# EasyEDA Pro project New Project_2025-03-25_15-12-27.eprj, board PCB1_1
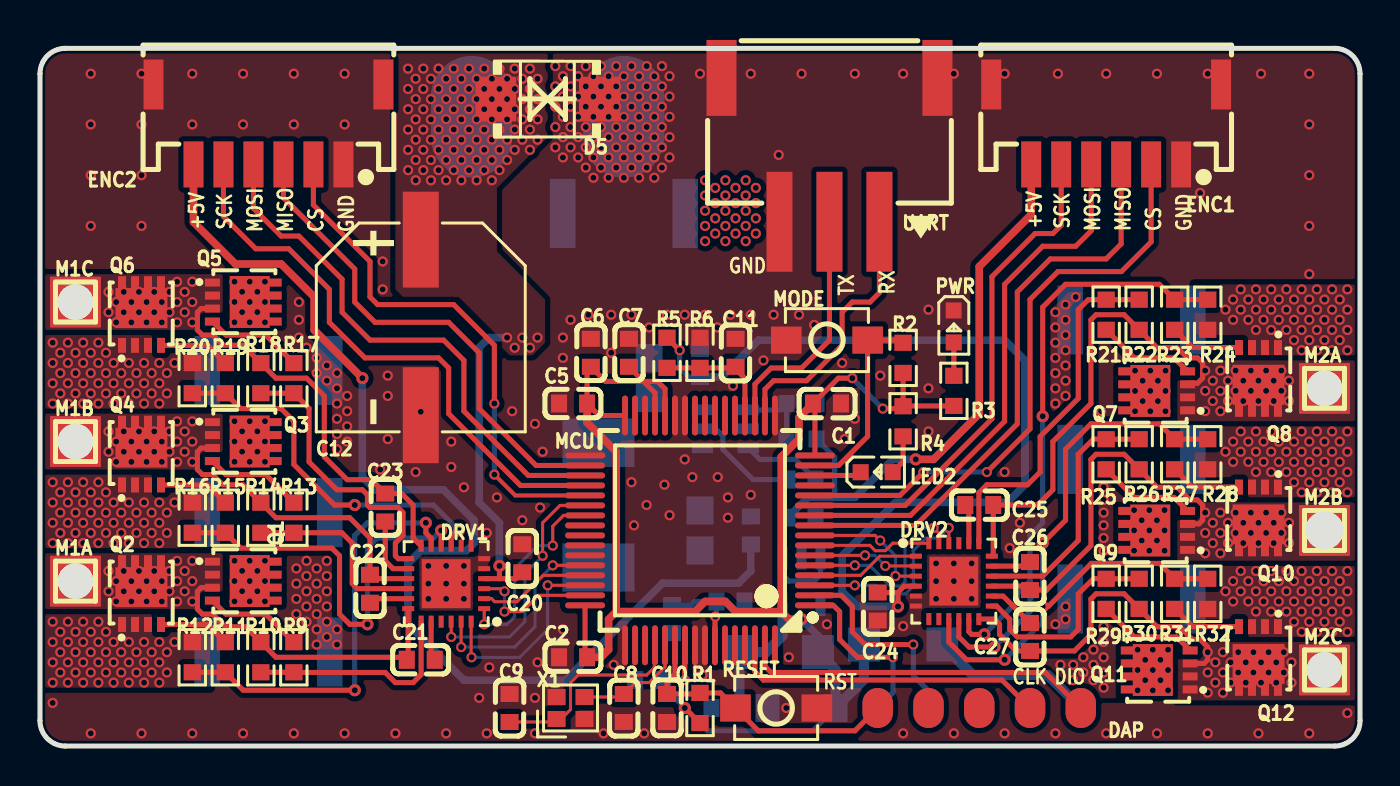
[diagram p6: board, top side]
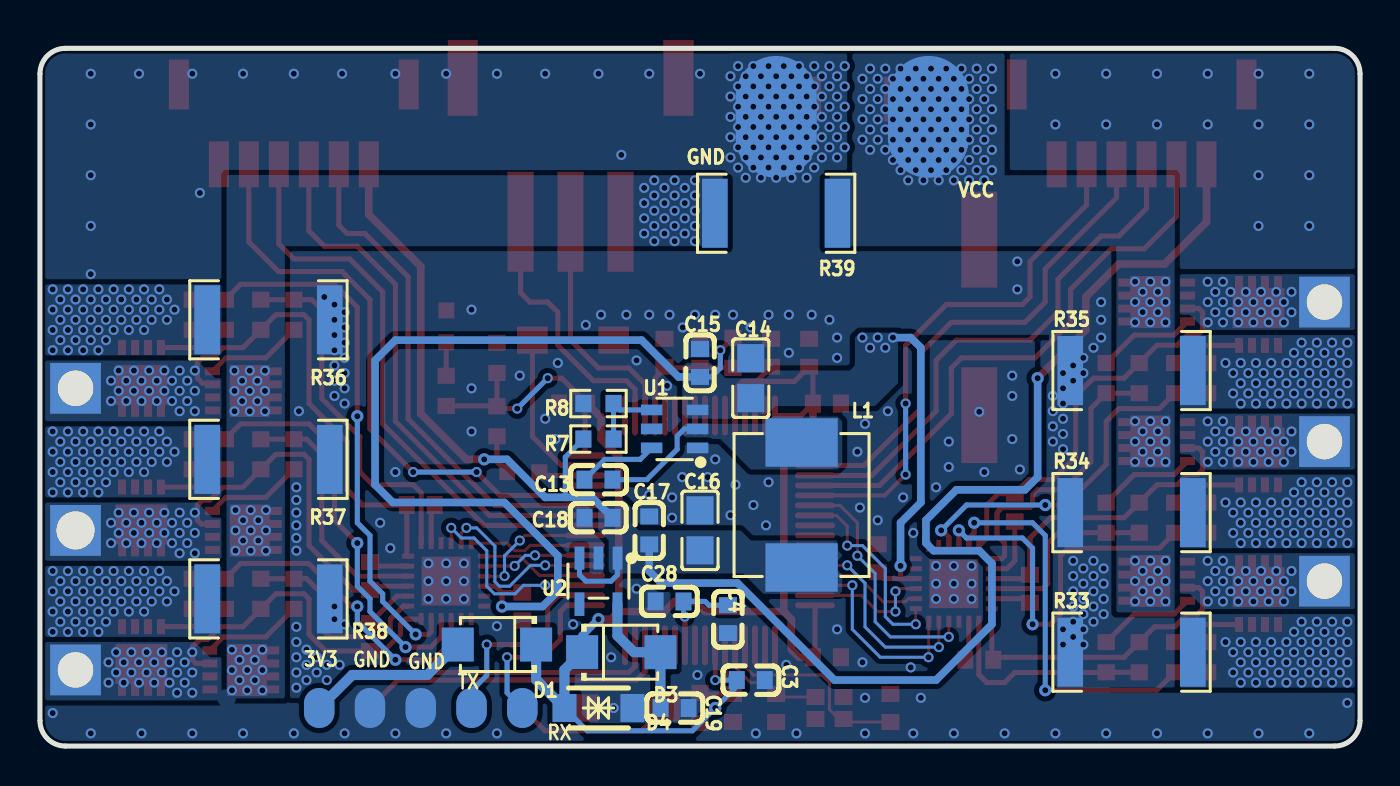
[diagram p7: board, bottom side, seen from below]

Outline 66.04 x 34.92 mm; copper layers: Top Layer, Inner1, Inner2, Bottom Layer. Coordinates in mm from the lower left corner of the outline.
Outline path: 0,33.66 arc(0.37,34.55) 1.27,34.92 64.77,34.92 arc(65.67,34.55) 66.04,33.66 66.04,1.27 arc(65.67,0.37) 64.77,0 1.27,0 arc(0.37,0.37) 0,1.27 0,33.66
Stack: Top Layer 0.035mm 外层铜厚1oz / Dielectric1 0.2104mm 7628 RC49% 8.6mil / Inner1 0.0152mm 内层铜厚 / Dielectric2 1.065mm 1.1mm H/HOZ 含铜 / Inner2 0.0152mm 内层铜厚 / Dielectric3 0.2104mm 7628 RC49% 8.6mil / Bottom Layer 0.035mm 外层铜厚1oz

## Design rules (mm)
template: 自定义配置
spacing copperThickness1oz (default): track to track 0.102, other pairs 0.152 to 0.3
spacing copperThickness2oz: track to track 0.203, other pairs 0.152 to 0.3
track width copperThickness1oz (default): min 0.127, default 0.254, max 2.54
track width copperThickness2oz: min 0.203, default 0.254, max 2.54
differential pair differentialPair (default): width min 0.127, default 0.254, max 2.54; gap min 0.152, default 0.152
via viaSize (default): diameter min 0.5, default 0.508, max 10; hole min 0.3, default 0.305, max 6.3

## Placement (name value [footprint] x y rotation side)
C1  100nF  [C0603]  39.37 17.14 180 top
C2  100nF  [C0603]  26.67 4.45 0 top
C3  100nF  [C0603]  30.48 3.3 0 bottom
C4  4.7uF  [C0603]  31.62 6.35 90 bottom
C5  100nF  [C0603]  26.67 17.14 0 top
C6  100nF  [C0603]  27.56 19.69 270 top
C7  100nF  [C0603]  29.46 19.69 270 top
C8  20pF  [C0603]  29.21 1.91 90 top
C9  20pF  [C0603]  23.49 1.91 90 top
C10  100nF  [C0603]  31.37 1.91 270 top
C11  1uF  [C0603]  34.8 19.69 90 top
C12  470uF  [CAP-SMD_BD10.0-L10.3-W10.3-LS11.0-R-RD]  19.05 20.95 90 top
C13  100nF  [C0603]  38.1 13.34 0 bottom
C14  22uF  [C0805]  30.48 18.42 270 bottom
C15  100nF  [C0603]  33.02 19.18 270 bottom
C16  22uF  [C0805]  33.02 10.8 90 bottom
C17  100nF  [C0603]  35.56 10.8 90 bottom
C18  1uF  [C0603]  38.1 11.43 180 bottom
C19  100nF  [C0603]  34.29 1.91 0 bottom
C20  1uF  [C0603]  24.13 9.4 90 top
C21  1uF  [C0603]  19.05 4.32 0 top
C22  1uF  [C0603]  16.51 7.87 270 top
C23  1uF  [C0603]  17.27 11.94 270 top
C24  1uF  [C0603]  41.91 6.98 270 top
C25  1uF  [C0603]  46.99 12.06 180 top
C26  1uF  [C0603]  49.53 8.51 90 top
C27  1uF  [C0603]  49.53 5.46 90 top
C28  100nF  [C0603]  34.54 7.24 180 bottom
D1  SS54F  [SMAF_L3.5-W2.6-LS4.7-RD-1]  43.18 5.08 0 bottom
D3  SS54F  [SMAF_L3.5-W2.6-LS4.7-RD-1]  36.96 4.7 180 bottom
D4  SMF3.3CA  [SOD-123FL_L2.8-W1.8-LS3.7-BI]  38.1 1.91 0 bottom
D5  SMBJ12CA  [SMB_L4.6-W3.6-LS5.4-BI]  25.4 32.39 180 top
DAP  SWD  [2X5 2.54MM双层贴片焊盘]  46.99 1.91 270 top
DRV1  DRV8300DRGER  [VQFN-24_L4.0-W4.0-P0.50-TL-EP2.5]  20.32 8.13 180 top
DRV2  DRV8300DRGER  [VQFN-24_L4.0-W4.0-P0.50-TL-EP2.5]  45.72 8.25 0 top
ENC1  ZX-ZH1.5-6PWT  [CONN-SMD_6P-P1.50_ZX-ZH1.5-6PWT]  53.34 31.11 180 top
ENC2  ZX-ZH1.5-6PWT  [CONN-SMD_6P-P1.50_ZX-ZH1.5-6PWT]  11.43 31.11 180 top
GND  -  [焊盘]  29.21 31.5 270 bottom
L1  15uH  [IND-SMD_L7.0-W6.6_FXL0630]  27.94 12.06 270 bottom
LED2  -  [LED_0603]  41.91 13.72 0 top
M1A  -  [hdr-th_1p-v-m_xkb_x4611wv-01i-c28d40]  1.78 8.25 0 top
M1B  -  [hdr-th_1p-v-m_xkb_x4611wv-01i-c28d40]  1.78 15.24 0 top
M1C  -  [hdr-th_1p-v-m_xkb_x4611wv-01i-c28d40]  1.78 22.23 0 top
M2A  -  [hdr-th_1p-v-m_xkb_x4611wv-01i-c28d40]  64.26 17.91 0 top
M2B  -  [hdr-th_1p-v-m_xkb_x4611wv-01i-c28d40#2]  64.26 10.8 0 top
M2C  -  [hdr-th_1p-v-m_xkb_x4611wv-01i-c28d40]  64.26 3.81 0 top
MCU  CYT2BL3CAAQ0AZEGST  [LQFP-64_L10.0-W10.0-P0.50-LS12.0-BL]  33.02 10.8 90 top
MODE  -  [Key_SMD_3x4x2]  39.37 20.32 180 top
PWR  -  [LED_0603]  45.72 20.95 270 top
Q1  WSD4070DN33  [PDFN3333-8_L3.1-W3.2-P0.65-LS3.4-BL]  10.16 8.25 270 top
Q2  WSD4070DN33  [PDFN3333-8_L3.1-W3.2-P0.65-LS3.4-BL]  5.08 7.62 0 top
Q3  WSD4070DN33  [PDFN3333-8_L3.1-W3.2-P0.65-LS3.4-BL]  10.16 15.24 270 top
Q4  WSD4070DN33  [PDFN3333-8_L3.1-W3.2-P0.65-LS3.4-BL]  5.08 14.61 0 top
Q5  WSD4070DN33  [PDFN3333-8_L3.1-W3.2-P0.65-LS3.4-BL]  10.16 22.23 270 top
Q6  WSD4070DN33  [PDFN3333-8_L3.1-W3.2-P0.65-LS3.4-BL]  5.08 21.59 0 top
Q7  WSD4070DN33  [PDFN3333-8_L3.1-W3.2-P0.65-LS3.4-BL]  55.88 17.78 90 top
Q8  WSD4070DN33  [PDFN3333-8_L3.1-W3.2-P0.65-LS3.4-BL]  60.96 18.42 180 top
Q9  WSD4070DN33  [PDFN3333-8_L3.1-W3.2-P0.65-LS3.4-BL]  55.88 10.8 90 top
Q10  WSD4070DN33  [PDFN3333-8_L3.1-W3.2-P0.65-LS3.4-BL]  60.96 11.43 180 top
Q11  WSD4070DN33  [PDFN3333-8_L3.1-W3.2-P0.65-LS3.4-BL]  56.01 3.81 90 top
Q12  WSD4070DN33  [PDFN3333-8_L3.1-W3.2-P0.65-LS3.4-BL]  60.96 4.45 180 top
R1  10K  [R0603]  33.02 1.91 270 top
R2  4.7K  [R0603]  43.18 19.43 90 top
R3  4.7K  [R0603]  45.72 17.78 90 top
R4  4.7K  [R0603]  43.18 16.26 270 top
R5  100K  [R0603]  31.37 19.69 270 top
R6  10K  [R0603]  33.02 19.69 90 top
R7  100K  [R0603]  38.1 15.37 180 bottom
R8  13.3K  [R0603]  38.1 17.14 0 bottom
R9  10  [R0603]  12.7 4.45 270 top
R10  10K  [R0603]  11.05 4.45 90 top
R11  10  [R0603]  9.27 4.45 270 top
R12  10K  [R0603]  7.62 4.45 90 top
R13  10  [R0603]  12.7 11.43 270 top
R14  10K  [R0603]  11.05 11.43 90 top
R15  10  [R0603]  9.27 11.43 270 top
R16  10K  [R0603]  7.62 11.43 90 top
R17  10  [R0603]  12.7 18.42 270 top
R18  10K  [R0603]  11.05 18.42 90 top
R19  10  [R0603]  9.27 18.42 270 top
R20  10K  [R0603]  7.62 18.42 90 top
R21  10  [R0603]  53.34 21.59 90 top
R22  10K  [R0603]  54.99 21.59 270 top
R23  10  [R0603]  56.77 21.59 90 top
R24  10K  [R0603]  58.42 21.59 270 top
R25  10  [R0603]  53.34 14.61 90 top
R26  10K  [R0603]  54.99 14.61 270 top
R27  10  [R0603]  56.77 14.61 90 top
R28  10K  [R0603]  58.42 14.61 270 top
R29  10  [R0603]  53.34 7.62 90 top
R30  10K  [R0603]  54.99 7.62 270 top
R31  10  [R0603]  56.77 7.62 90 top
R32  10K  [R0603]  58.42 7.62 270 top
R33  1mΩ  [R2512]  11.43 4.7 180 bottom
R34  1mΩ  [R2512]  11.43 11.68 180 bottom
R35  1mΩ  [R2512]  11.43 18.8 180 bottom
R36  1mΩ  [R2512]  54.61 21.34 0 bottom
R37  1mΩ  [R2512]  54.61 14.35 0 bottom
R38  1mΩ  [R2512]  54.61 7.37 0 bottom
R39  1mΩ  [R2512]  29.21 26.67 0 bottom
RESET  -  [Key_SMD_3x4x2]  36.83 1.91 0 top
U1  TPS54202DDCR  [SOT-23-6_L2.9-W1.6-P0.95-LS2.8-BL]  34.29 15.88 90 bottom
U2  RT9013-33GB  [SOT-23-5_L3.0-W1.7-P0.95-LS2.8-BL]  38.1 8.25 0 bottom
UART  HX 2.54-3P WT  [CONN-SMD_3P-P2.50_HX-2.54-3P-WT]  39.5 29.84 180 top
VCC  -  [焊盘]  21.59 31.5 270 bottom
X1  16MHz  [CRYSTAL-SMD_4P-L2.0-W1.6-BL]  26.54 1.91 0 top

## Footprints (pads in the part's own frame, mm; a bottom-side part is the same pattern mirrored in y, then rotated)
2X5 2.54MM双层贴片焊盘
  oval 2x1.524 smd: 1(0,-5.08) 3(0,-2.54) 5(0,0) 7(0,2.54) 9(0,5.08)
  oval 2x1.524 smd far side: 2(0,-5.08) 4(0,-2.54) 6(0,0) 8(0,2.54) 10(0,5.08)
C0603
  rect 0.8x0.9 smd: 1(-0.7,0) 2(0.7,0)
C0805
  rect 1.41x1.35 smd: 1(-1,0) 2(1,0)
CAP-SMD_BD10.0-L10.3-W10.3-LS11.0-R-RD
  rect 4.8x1.8 smd: 1(4.395,0) 2(-4.395,0)
CONN-SMD_3P-P2.50_HX-2.54-3P-WT
  rect 1.3x5 smd: 1(-2.5,3.6) 2(0,3.6) 3(2.5,3.6)
  rect 1.5x3.8 smd: 4(5.4,-3.6) 5(-5.4,-3.6)
CONN-SMD_6P-P1.50_ZX-ZH1.5-6PWT
  rect 1x2.3 smd: 1(-3.75,2) 2(-2.25,2) 3(-0.75,2) 4(0.75,2) 5(2.25,2) 6(3.75,2)
  rect 1x2.5 smd: 7(5.75,-2) 8(-5.75,-2)
CRYSTAL-SMD_4P-L2.0-W1.6-BL
  rect 0.9x0.8 smd: 1(-0.7,-0.55) 2(0.7,-0.55) 3(0.7,0.55) 4(-0.7,0.55)
hdr-th_1p-v-m_xkb_x4611wv-01i-c28d40
  rect 2.54x2.54 hole 1.778: 1(0,0)
hdr-th_1p-v-m_xkb_x4611wv-01i-c28d40#2
  rect 2.54x2.54 hole 1.905x1.778: 1(0,0)
IND-SMD_L7.0-W6.6_FXL0630
  rect 2.424x3.62 smd: 1(3.128,0) 2(-3.128,0)
Key_SMD_3x4x2
  rect 1.53x1.36 smd: 1(-2.035,0) 2(2.035,0)
LED_0603
  rect 0.8x0.8 smd: 1(-0.851,-0.01) 2(0.75,-0.005)
LQFP-64_L10.0-W10.0-P0.50-LS12.0-BL
  oval 0.3x2 smd: 1(-3.75,-5.75) 2(-3.25,-5.75) 3(-2.75,-5.75) 4(-2.25,-5.75) 5(-1.75,-5.75) 6(-1.25,-5.75) 7(-0.75,-5.75) 8(-0.25,-5.75) 9(0.25,-5.75) 10(0.75,-5.75) 11(1.25,-5.75) 12(1.75,-5.75) 13(2.25,-5.75) 14(2.75,-5.75) 15(3.25,-5.75) 16(3.75,-5.75) 33(3.75,5.75) 34(3.25,5.75) 35(2.75,5.75) 36(2.25,5.75) 37(1.75,5.75) 38(1.25,5.75) 39(0.75,5.75) 40(0.25,5.75) 41(-0.25,5.75) 42(-0.75,5.75) 43(-1.25,5.75) 44(-1.75,5.75) 45(-2.25,5.75) 46(-2.75,5.75) 47(-3.25,5.75) 48(-3.75,5.75)
  oval 2x0.3 smd: 17(5.75,-3.75) 18(5.75,-3.25) 19(5.75,-2.75) 20(5.75,-2.25) 21(5.75,-1.75) 22(5.75,-1.25) 23(5.75,-0.75) 24(5.75,-0.25) 25(5.75,0.25) 26(5.75,0.75) 27(5.75,1.25) 28(5.75,1.75) 29(5.75,2.25) 30(5.75,2.75) 31(5.75,3.25) 32(5.75,3.75) 49(-5.75,3.75) 50(-5.75,3.25) 51(-5.75,2.75) 52(-5.75,2.25) 53(-5.75,1.75) 54(-5.75,1.25) 55(-5.75,0.75) 56(-5.75,0.25) 57(-5.75,-0.25) 58(-5.75,-0.75) 59(-5.75,-1.25) 60(-5.75,-1.75) 61(-5.75,-2.25) 62(-5.75,-2.75) 63(-5.75,-3.25) 64(-5.75,-3.75)
PDFN3333-8_L3.1-W3.2-P0.65-LS3.4-BL
  rect 0.4x0.75 smd: 1(-0.975,-1.534) 2(-0.325,-1.534) 3(0.325,-1.534) 4(0.975,-1.534)
  rect 0.4x0.8 smd: 5(0.975,1.534) 6(0.325,1.534) 7(-0.325,1.534) 8(-0.975,1.534)
  rect 2.6x2 smd: 9(-0.004,0.333)
R0603
  rect 0.806x0.864 smd: 1(-0.753,0) 2(0.753,0)
R2512
  rect 1.282x3.456 smd: 1(-3.067,0) 2(3.067,0)
SMAF_L3.5-W2.6-LS4.7-RD-1
  rect 1.6x1.7 smd: 1(-1.96,0) 2(1.96,0)
SMB_L4.6-W3.6-LS5.4-BI
  rect 2.047x2.241 smd: 1(-2.591,0) 2(2.591,0)
SOD-123FL_L2.8-W1.8-LS3.7-BI
  rect 1.2x1.4 smd: 1(-1.7,0) 2(1.7,0)
SOT-23-5_L3.0-W1.7-P0.95-LS2.8-BL
  rect 0.49x1.157 smd: 1(-0.95,-1.153) 2(0,-1.153) 3(0.95,-1.153)
  rect 0.49x1.175 smd: 4(0.95,1.153) 5(-0.95,1.153)
SOT-23-6_L2.9-W1.6-P0.95-LS2.8-BL
  rect 0.532x1.072 smd: 1(-0.95,-1.149) 2(0,-1.149) 3(0.95,-1.149) 4(0.95,1.149) 5(0,1.149) 6(-0.95,1.149)
VQFN-24_L4.0-W4.0-P0.50-TL-EP2.5
  rect 0.6x0.25 smd: 1(-1.9,1.25) 2(-1.9,0.75) 3(-1.9,0.25) 4(-1.9,-0.25) 5(-1.9,-0.75) 6(-1.9,-1.25) 13(1.9,-1.25) 14(1.9,-0.75) 15(1.9,-0.25) 16(1.9,0.25) 17(1.9,0.75) 18(1.9,1.25)
  rect 0.25x0.6 smd: 7(-1.25,-1.9) 8(-0.75,-1.9) 9(-0.25,-1.9) 10(0.249,-1.9) 11(0.75,-1.9) 12(1.25,-1.9) 19(1.25,1.9) 20(0.75,1.9) 21(0.249,1.9) 22(-0.25,1.9) 23(-0.75,1.9) 24(-1.25,1.9)
  rect 2.45x2.45 smd: 25(0,0)
焊盘
  oval 6.096x4.064 smd: 1(0,0)

## Nets
As in the schematic.

Pads without a net: DAP 3 5; DRV1 7 8 21; DRV2 7 8 21; MCU 13 21 22 23 24 25 30 31 40 41 42 43 50 51 59 60 61 64; U1 5; U2 4

## Via types
v1: diameter 0.508, hole 0.305, Top Layer to Bottom Layer, 32 vias
v2: diameter 0.61, hole 0.305, Top Layer to Bottom Layer, 18 vias
v3: diameter 0.508, hole 0.3, Top Layer to Bottom Layer, 971 vias

## Routing (per net, layer and track width the routed paths; a pad name or vN(x,y) marks a point on that pad's centre or on a via; arc(x,y) is an arc through that point)
+3.3V: length 86.1
  Top Layer w0.254: R4.1 R2.1 ; R4.1 43.2,17.03 R3.1 ; R4.1 43.06,16.89 v1(42.16,16.89) ; 30.2,18.25 28.29,18.25 C6.2 27.37,18.8 C5.2 27.97,16.55 MCU.32 ; 30.2,18.25 C7.2 ; 30.2,18.25 30.9,18.25 31.27,17.88 MCU.28 ; 30.2,18.25 30.77,17.68 MCU.29 ; C2.2 27.27,4.55 MCU.48 ; v1(40.64,18.42) 39.94,18.42 C1.2 38.77,17.05 MCU.16 ; R1.2 32.27,1.91 v2(32.26,1.91) ; MCU.55 32.26,5.03 v1(32.26,3.3)
  Top Layer w0.381: 37.08,6.73 34.8,6.73 34.29,7.24 33.27,7.24 32.77,6.73 28.83,6.73 ; 37.08,6.73 37.46,6.35 v2(38.1,6.35) ; 37.08,6.73 37.08,14.48 37.97,15.37 37.97,16.45 C1.2 ; 28.83,6.73 28.83,14.73 27.37,16.19 C5.2 ; 28.83,6.73 28.45,6.35 28.45,4.83 28.07,4.45 C2.2
  Bottom Layer w0.254: D4.2 38.66,0.76 33.4,0.76 v2(32.26,1.91) 31.18,2.98 C3.2 v1(32.26,3.3) ; v1(40.64,18.42) v1(42.16,16.89)
  Bottom Layer w0.381: 38.92,4.7 38.92,5.53 v2(38.1,6.35)
  Bottom Layer w0.508: 38.92,4.7 39.8,3.82 D4.2 41.22,3.33 D1.1
+5V: length 89.2
  Top Layer w0.381: ENC2.6 7.68,26.23 9.78,24.13 12.06,24.13 13.72,22.48 13.72,20.83 v2(16.13,18.42) ; v2(43.81,14.35) 44.7,14.35 46.99,16.64 46.99,24 49.59,26.6 ENC1.6
  Bottom Layer w0.254: 39.76,12.45 39.76,14.46 R7.1 ; U2.3 39.05,8.57 38.73,8.25 37.46,8.25 37.15,8.57 U2.1
  Bottom Layer w0.381: C18.2 38.42,12.45 40.77,12.45 42.67,14.35 v2(43.81,14.35) ; v2(16.13,18.42) 16.13,13.46 16.76,12.83 20.19,12.83 21.72,11.3 21.72,10.16 21.34,9.78 19.05,9.78 18.42,9.14 18.42,6.1 21.21,3.3 26.29,3.3 31.15,8.16 34.96,8.16 35.56,8.76 C17.1
GND:
  vias: v3(0.63,2.16) v3(2.54,33.66) v3(2.54,31.11) v3(2.54,28.58) v3(2.54,26.03) v3(2.54,0.64) v3(5.08,33.66) v3(5.08,31.11) v3(5.08,28.58) v3(5.08,26.03) v3(5.08,0.64) v3(7.62,33.66) v3(7.62,31.11) v3(7.62,0.64) v3(10.16,33.66) v3(10.16,31.11) v3(10.16,0.64) v3(12.7,33.66) v3(12.7,31.11) v3(12.7,0.64) v3(12.83,8.89) v3(12.83,8.13) v3(12.83,7.37) v3(12.83,6.6) v3(12.95,22.23) v3(12.95,21.34) v3(12.95,20.45) v3(13.33,19.94) v3(13.33,9.27) v3(13.33,8.51) v3(13.33,7.75) v3(13.33,6.98) v3(13.33,6.22) v3(13.84,19.43) v3(13.84,18.67) v3(13.84,8.89) v3(13.84,8.13) v3(13.84,7.37) v3(13.84,6.6) v3(13.84,5.84) v3(13.84,5.08) v3(14.35,19.05) v3(14.35,18.29) v3(14.35,9.27) v3(14.35,8.51) v3(14.35,7.75) v3(14.35,6.98) v3(14.35,6.22) v3(14.35,5.46) v3(14.86,18.67) v3(14.86,17.91) v3(14.86,17.14) v3(14.86,16.38) v3(14.86,15.62) v3(14.86,14.86) v3(14.86,5.84) v3(14.86,5.08) v3(15.24,33.66) v3(15.24,31.11) v3(15.24,0.64) v3(15.37,17.53) v3(15.37,16.76) v3(15.37,16) v3(15.37,15.24) v3(17.02,13.84) v3(17.14,24.26) v3(17.14,22.86) v3(17.4,18.54) v3(17.4,17.53) v3(17.4,15.37) v3(17.78,0.64) v3(18.8,13.72) v3(19.05,16.73) v3(19.43,9.02) v3(19.43,8.13) v3(19.43,7.37) v3(20.32,9.02) v3(20.32,8.13) v3(20.32,7.37) v3(20.32,0.64) v3(20.57,15.24) v3(20.57,13.97) v3(21.21,12.95) v3(21.21,9.02) v3(21.21,8.13) v3(21.21,7.37) v3(21.97,2.41) v3(22.35,10.67) v3(22.35,0.64) v3(22.48,3.94) v3(22.86,12.45) v3(23.62,16.76) v3(24.13,11.3) v3(24.77,16.13) v3(24.77,2.41) v3(24.77,0.64) v3(24.89,4.19) v3(25.02,11.94) v3(25.15,14.73) v3(25.78,34.04) v3(25.78,33.02) v3(25.78,32) v3(25.78,30.99) v3(25.78,29.97) v3(26.16,33.53) v3(26.16,32.51) v3(26.16,31.5) v3(26.16,30.48) v3(26.16,29.46) v3(26.16,20.45) v3(26.16,19.43) v3(26.16,5.84) v3(26.54,34.04) v3(26.54,33.02) v3(26.54,32) v3(26.54,30.99) v3(26.54,29.97) v3(26.54,21.34) v3(26.92,33.53) v3(26.92,32.51) v3(26.92,31.5) v3(26.92,30.48) v3(26.92,29.46) v3(27.3,34.04) v3(27.3,33.02) v3(27.3,32) v3(27.3,30.99) v3(27.3,29.97) v3(27.3,28.96) v3(27.43,21.59) v3(27.69,33.53) v3(27.69,32.51) v3(27.69,31.5) v3(27.69,30.48) v3(27.69,29.46) v3(27.69,28.45) v3(28.07,34.04) v3(28.07,33.02) v3(28.07,32) v3(28.07,30.99) v3(28.07,29.97) v3(28.07,28.96) v3(28.19,0.64) v3(28.45,33.53) v3(28.45,32.51) v3(28.45,31.5) v3(28.45,30.48) v3(28.45,29.46) v3(28.45,28.45) v3(28.58,21.59) v3(28.58,19.69) v3(28.7,4.06) v3(28.83,34.04) v3(28.83,33.02) v3(28.83,32) v3(28.83,30.99) v3(28.83,29.97) v3(28.83,28.96) v3(29.21,33.53) v3(29.21,32.51) v3(29.21,31.5) v3(29.21,30.48) v3(29.21,29.46) v3(29.21,28.45) v3(29.59,34.04) v3(29.59,33.02) v3(29.59,32) v3(29.59,30.99) v3(29.59,29.97) v3(29.59,28.96) v3(29.59,21.59) v3(29.59,13.21) v3(29.72,11.05) v3(29.97,33.53) v3(29.97,32.51) v3(29.97,31.5) v3(29.97,30.48) v3(29.97,29.46) v3(29.97,28.45) v3(30.23,0.64) v3(30.35,34.04) v3(30.35,33.02) v3(30.35,32) v3(30.35,30.99) v3(30.35,29.97) v3(30.35,28.96) v3(30.35,12.06) v3(30.48,20.95) v3(30.73,33.53) v3(30.73,32.51) v3(30.73,31.5) v3(30.73,30.48) v3(30.73,29.46) v3(30.73,28.45) v3(31.11,34.04) v3(31.11,33.02) v3(31.11,32) v3(31.11,30.99) v3(31.11,29.97) v3(31.11,28.96) v3(31.24,13.08) v3(31.37,21.59) v3(31.5,33.53) v3(31.5,32.51) v3(31.5,31.5) v3(31.5,30.48) v3(31.5,29.46) v3(31.5,11.56) v3(32.26,21.59) v3(32.26,14.35) v3(32.64,13.46) v3(33.02,33.66) v3(33.15,3.56) v3(33.27,21.59) v3(33.88,20.95) v3(33.91,13.46) v3(34.42,12.45) v3(34.42,11.43) v3(34.54,21.59) v3(34.67,18.03) v3(35.56,33.66) v3(35.56,21.59) v3(35.56,12.57) v3(36.2,19.3) v3(36.2,7.87) v3(36.7,21.59) v3(36.96,29.59) v3(37.34,1.91) v3(37.46,4.45) v3(37.97,21.59) v3(38.1,33.66) v3(38.73,21.08) v3(39.37,6.1) v3(40.13,19.18) v3(40.26,15.37) v3(40.77,33.66) v3(40.77,16.38) v3(42.04,18.54) v3(43.18,33.66) v3(43.18,6) v3(43.18,0.64) v3(44.45,21.84) v3(44.45,17.91) v3(44.45,15.75) v3(44.83,9.14) v3(44.83,8.25) v3(44.83,7.37) v3(45.72,33.66) v3(45.72,9.14) v3(45.72,8.25) v3(45.72,7.37) v3(45.72,0.64) v3(46.61,9.14) v3(46.61,8.25) v3(46.61,7.37) v3(48.26,33.66) v3(48.26,13.72) v3(48.26,0.64) v3(48.51,9.91) v3(49.02,11.18) v3(50.8,21.72) v3(50.8,20.95) v3(50.8,20.19) v3(50.8,19.43) v3(50.8,18.67) v3(50.8,17.91) v3(50.8,17.14) v3(50.8,6.1) v3(50.8,0.64) v3(50.93,33.66) v3(51.05,4.06) v3(51.31,22.1) v3(51.31,21.34) v3(51.31,20.57) v3(51.31,19.81) v3(51.31,19.05) v3(51.31,18.29) v3(51.31,17.53) v3(51.31,6.98) v3(51.31,6.35) v3(51.69,4.06) v3(51.69,3.3) v3(51.82,22.48) v3(52.2,4.45) v3(52.2,3.68) v3(52.7,4.83) v3(52.7,4.06) v3(52.7,3.3) v3(53.09,16.76) v3(53.21,12.95) v3(53.21,12.32) v3(53.21,11.68) v3(53.21,11.05) v3(53.21,10.41) v3(53.21,9.78) v3(53.21,5.97) v3(53.21,5.21) v3(53.21,4.45) v3(53.21,3.68) v3(53.21,2.92) v3(53.34,33.66) v3(53.34,0.64) v3(55.88,33.66) v3(55.88,0.64) v3(58.04,27.69) v3(58.42,33.66) v3(58.42,0.64) v3(60.96,0.64) v3(61.09,33.66) v3(63.5,33.66) v3(63.5,31.11) v3(63.5,28.58) v3(63.5,26.03) v3(63.5,23.62) v3(63.5,0.64) v3(65.4,1.65)
ADC_BAT: length 6.1
  Top Layer w0.254: 34.74,18.93 35.27,18.41 MCU.20 ; 34.74,18.93 R6.1 R5.2 ; 34.74,18.93 C11.1
BAT: length 60.6
  Top Layer w0.254: 24.13,8.7 23.81,8.38 22.97,8.38 ; C24.1 42.92,7.69 ; 42.92,7.69 43.24,8 DRV2.4 ; 42.92,7.69 42.93,7.68 v2(42.93,6.98) ; 22.97,8.38 22.99,8.4 v2(22.99,9.02) ; 22.97,8.38 DRV1.4 ; v1(32,19.81) 32,19.81 R5.1
  Bottom Layer w0.254: 26.16,26.67 R39.1 ; v1(32,19.81) 32,18.92 32.45,18.48 C15.2
  Bottom Layer w0.381: v1(23.37,20.45) 22.48,20.45 21.97,19.94 21.97,12.19 22.99,11.18 v2(22.99,9.02) ; C15.2 34.1,18.48 35.94,20.32 48.26,20.32 49.28,19.3 49.28,13.08 48.39,12.19 42.8,12.19 40.13,9.53 40.13,7.75 40.89,6.98 v2(42.93,6.98)
  vias: v1(23.75,19.94) v1(24.13,20.45) v1(24.51,19.94) v1(24.89,20.45) v3(9.73,23.25) v3(9.73,22.23) v3(9.73,21.21) v3(9.73,16.26) v3(9.73,15.24) v3(9.73,14.23) v3(9.73,9.28) v3(9.73,8.26) v3(9.73,7.24) v3(10.11,22.74) v3(10.11,21.72) v3(10.11,15.75) v3(10.11,14.74) v3(10.11,8.77) v3(10.11,7.75) v3(10.49,23.25) v3(10.49,22.23) v3(10.49,21.21) v3(10.49,16.26) v3(10.49,15.24) v3(10.49,14.23) v3(10.49,9.28) v3(10.49,8.26) v3(10.49,7.24) v3(10.87,22.74) v3(10.87,21.72) v3(10.87,15.75) v3(10.87,14.74) v3(10.87,8.77) v3(10.87,7.75) v3(11.26,23.25) v3(11.26,22.23) v3(11.26,21.21) v3(11.26,16.26) v3(11.26,15.24) v3(11.26,14.23) v3(11.26,9.28) v3(11.26,8.26) v3(11.26,7.24) v3(18.42,33.91) v3(18.42,32.89) v3(18.42,31.88) v3(18.42,30.86) v3(18.42,29.84) v3(18.42,28.83) v3(18.8,33.4) v3(18.8,32.39) v3(18.8,31.37) v3(18.8,30.35) v3(18.8,29.34) v3(18.8,28.32) v3(19.18,33.91) v3(19.18,32.89) v3(19.18,31.88) v3(19.18,30.86) v3(19.18,29.84) v3(19.18,28.83) v3(19.56,33.4) v3(19.56,32.39) v3(19.56,31.37) v3(19.56,30.35) v3(19.56,29.34) v3(19.56,28.32) v3(19.94,33.91) v3(19.94,32.89) v3(19.94,31.88) v3(19.94,30.86) v3(19.94,29.84) v3(19.94,28.83) v3(20.32,33.4) v3(20.32,32.39) v3(20.32,31.38) v3(20.32,30.35) v3(20.32,29.34) v3(20.32,28.32) v3(20.7,33.91) v3(20.7,32.89) v3(20.7,31.88) v3(20.7,30.86) v3(20.7,29.84) v3(20.7,28.83) v3(21.08,33.4) v3(21.08,32.39) v3(21.08,31.37) v3(21.08,30.35) v3(21.08,29.34) v3(21.08,28.32) v3(21.46,33.91) v3(21.46,32.89) v3(21.46,31.88) v3(21.46,30.86) v3(21.46,29.84) v3(21.46,28.83) v3(21.84,33.4) v3(21.84,32.39) v3(21.84,31.37) v3(21.84,30.35) v3(21.84,29.34) v3(21.84,28.32) v3(22.23,33.91) v3(22.23,32.89) v3(22.23,31.88) v3(22.23,30.86) v3(22.23,29.84) v3(22.23,28.83) v3(22.61,33.4) v3(22.61,32.39) v3(22.61,31.37) v3(22.61,30.35) v3(22.61,29.34) v3(22.61,28.32) v3(22.99,33.91) v3(22.99,32.89) v3(22.99,31.88) v3(22.99,30.86) v3(22.99,29.84) v3(22.99,28.83) v3(23.37,33.4) v3(23.37,32.39) v3(23.37,31.37) v3(23.37,30.35) v3(23.37,29.34) v3(23.75,33.91) v3(23.75,32.89) v3(23.75,31.88) v3(23.75,30.86) v3(23.75,29.84) v3(24.13,33.4) v3(24.13,32.39) v3(24.13,31.37) v3(24.13,30.35) v3(24.51,33.91) v3(24.51,32.89) v3(24.51,31.88) v3(24.51,30.86) v3(24.51,29.84) v3(24.89,33.4) v3(24.89,32.39) v3(24.89,31.37) v3(24.89,30.35) v3(33.27,28.32) v3(33.27,27.56) v3(33.27,26.8) v3(33.27,26.03) v3(33.27,25.27) v3(33.78,27.94) v3(33.78,27.18) v3(33.78,26.42) v3(33.78,25.65) v3(34.29,28.32) v3(34.29,27.56) v3(34.29,26.8) v3(34.29,26.03) v3(34.29,25.27) v3(34.8,27.94) v3(34.8,27.18) v3(34.8,26.42) v3(34.8,25.65) v3(35.31,28.32) v3(35.31,27.56) v3(35.31,26.8) v3(35.31,26.03) v3(35.31,25.27) v3(35.81,27.94) v3(35.81,27.18) v3(35.81,26.42) v3(35.81,25.65) v3(54.74,11.81) v3(54.74,10.8) v3(54.74,9.78) v3(54.78,18.79) v3(54.78,17.78) v3(54.78,16.76) v3(54.91,4.82) v3(54.91,3.81) v3(54.91,2.79) v3(55.17,18.28) v3(55.17,17.27) v3(55.12,11.3) v3(55.12,10.29) v3(55.29,4.31) v3(55.29,3.3) v3(55.55,18.79) v3(55.55,17.78) v3(55.55,16.76) v3(55.5,11.81) v3(55.5,10.8) v3(55.5,9.78) v3(55.67,4.82) v3(55.67,3.81) v3(55.67,2.79) v3(55.93,18.28) v3(55.93,17.27) v3(55.88,11.3) v3(55.88,10.29) v3(56.05,4.31) v3(56.05,3.3) v3(56.26,11.81) v3(56.26,10.8) v3(56.26,9.78) v3(56.31,18.79) v3(56.31,17.78) v3(56.31,16.76) v3(56.44,4.82) v3(56.44,3.81) v3(56.44,2.79)
DBG_CLK: length 15.8
  Top Layer w0.254: DAP.7 48.13,3.3 36.2,3.3 35.77,3.73 MCU.62
DBG_DIO: length 17.7
  Top Layer w0.254: MCU.63 36.27,3.99 36.58,3.68 50.29,3.68 DAP.9
DBG_RX: length 8.7
  Top Layer w0.254: MCU.1 39.69,7.05 40.01,6.73 40.01,5.33 40.89,4.45 v1(42.67,4.45)
  Bottom Layer w0.254: DAP.2 42.67,2.67 v1(42.67,4.45)
DBG_TX: length 10.2
  Top Layer w0.254: v1(43.69,5.08) 41.27,5.08 40.64,5.72 40.64,6.98 40.08,7.55 MCU.2
  Bottom Layer w0.254: v1(43.69,5.08) 43.69,3.53 44.45,2.77 DAP.4
ENC1_CS: length 29.7
  Top Layer w0.254: MCU.12 43.02,12.55 v1(44.2,13.72) ; v1(47.37,13.72) 49.53,15.88 49.53,22.35 50.93,23.75 54.1,23.75 55.59,25.24 ENC1.2
  Bottom Layer w0.254: v1(44.2,13.72) v1(47.37,13.72)
ENC1_MISO: length 29
  Top Layer w0.254: ENC1.3 54.09,25.13 53.34,24.38 50.55,24.38 48.89,22.73 48.89,16.13 43.81,11.05 MCU.9
ENC1_MOSI: length 27.1
  Top Layer w0.254: ENC1.4 52.59,25.79 51.82,25.02 50.17,25.02 48.26,23.11 48.26,16.26 43.55,11.55 MCU.10
ENC1_SCK: length 25.3
  Top Layer w0.254: ENC1.5 51.09,26.07 50.67,25.65 49.78,25.65 47.62,23.5 47.62,16.38 43.29,12.05 MCU.11
ENC2_CS: length 26.5
  Top Layer w0.203: v3(22.73,13.59) 23.78,12.55 MCU.37
  Top Layer w0.254: ENC2.2 13.68,27.09 16.51,24.26 16.51,22.48 16.89,22.1 20.7,22.1 22.73,20.06 v1(22.73,17.14)
  Bottom Layer w0.254: v3(22.73,13.59) v1(22.73,17.14)
ENC2_MISO: length 24.9
  Top Layer w0.254: MCU.34 24.82,14.05 21.97,16.89 21.97,19.69 20.45,21.21 16.76,21.21 15.75,22.23 15.75,23.88 12.18,27.44 ENC2.3
ENC2_MOSI: length 26.8
  Top Layer w0.254: ENC2.4 10.68,26.91 12.06,25.53 12.95,25.53 15.11,23.37 15.11,21.72 16.51,20.32 20.19,20.32 21.21,19.3 21.21,16.76 24.43,13.55 MCU.35
ENC2_SCK: length 28.6
  Top Layer w0.254: ENC2.5 9.18,26.51 10.8,24.89 12.45,24.89 14.48,22.86 14.48,21.21 16.26,19.43 19.94,19.43 20.45,18.92 20.45,16.64 24.04,13.05 MCU.36
HSE_IN: length 10.3
  Top Layer w0.152: MCU.52 30.73,5.01 30.73,3.94 30.35,3.56 26.92,3.56 26.54,3.17 26.54,1.83 26.07,1.36 X1.1 25.69,1.2 C9.1
HSE_OUT: length 5.7
  Top Layer w0.152: MCU.53 31.27,3.97 30.48,3.17 29.78,3.17 C8.2 29.06,2.45 27.24,2.45
KEY: length 9.9
  Top Layer w0.254: MCU.15 39.95,14.05 41.4,15.5 MODE.1 43.04,20.32 R2.2
LED: length 2.4
  Top Layer w0.254: MCU.14 40.9,13.55 LED2.1
M1AH: length 12.6
  Top Layer w0.152: MCU.38 26.02,12.05 25.15,11.18 v1(25.15,9.53) ; v1(20.57,5.46) 20.57,6.22 DRV1.22
  Bottom Layer w0.152: v1(20.57,5.46) 23.49,5.46 24.26,6.22 24.26,8.64 v1(25.15,9.53)
M1AL: length 10.1
  Top Layer w0.152: v1(25.65,10.03) 25.65,11 26.19,11.55 MCU.39 ; DRV1.1 22.23,6.87 v1(22.23,6.1)
  Bottom Layer w0.152: v1(25.65,10.03) 24.89,10.03 23.75,8.89 23.75,6.48 23.37,6.1 v1(22.23,6.1)
M1BH: length 10.5
  Top Layer w0.152: MCU.44 v1(25.65,9.05) ; v1(21.07,4.95) DRV1.23
  Bottom Layer w0.152: v1(21.07,4.95) 23.75,4.95 24.77,5.97 24.77,8.16 v1(25.65,9.05)
M1BL: length 5.7
  Top Layer w0.152: 27.23,8.51 MCU.45 25.18,8.55 23.86,7.23 22.75,7.23 22.59,7.38 DRV1.2
M1CH: length 10.3
  Top Layer w0.152: DRV1.24 21.57,4.47 v1(21.59,4.45) ; v1(25.4,8.05) MCU.46
  Bottom Layer w0.152: v1(21.59,4.45) 24,4.45 25.4,5.84 v1(25.4,8.05)
M1CL: length 6.5
  Top Layer w0.152: DRV1.3 23.11,7.88 v1(23.24,7.75) ; v1(23.24,6.73) 24.13,6.73 24.94,7.55 MCU.47
  Bottom Layer w0.152: v1(23.24,6.73) v1(23.24,7.75)
M1GHA: length 11.1
  Top Layer w0.254: R10.1 R9.2 12.71,3.68 17.27,3.68 17.78,3.17 18.67,3.17 19.07,3.58 DRV1.19
M1GHB: length 9.7
  Top Layer w0.254: DRV1.16 15.87,7.88 15.62,8.13 15.62,10.16 15.1,10.68 R13.2 R14.1
M1GHC: length 14.5
  Top Layer w0.254: R18.1 R17.2 13.46,16.9 13.46,14.22 14.86,12.83 16.13,12.83 16.38,12.57 16.38,12.06 16.51,11.94 17.91,11.94 18.16,11.68 18.16,10.54 17.78,10.16 17.78,9.53 17.93,9.38 DRV1.13
M1GLA: length 21.3
  Top Layer w0.254: DRV1.11 19.57,10.4 19.3,10.67 v2(19.3,11.18) ; R12.1 R11.2 10.17,2.79 v2(15.75,2.79)
  Bottom Layer w0.254: v2(19.3,11.18) 16.38,11.18 15.75,10.54 v2(15.75,2.79)
M1GLB: length 21
  Top Layer w0.254: v2(16.38,6.1) 15.49,6.1 14.99,6.6 14.99,9.53 14.61,9.91 10.04,9.91 R15.2 R16.1 ; DRV1.10 v2(20.07,10.8)
  Bottom Layer w0.254: v2(16.38,6.1) 16.38,9.91 16.89,10.41 19.69,10.41 v2(20.07,10.8)
M1GLC: length 18.4
  Top Layer w0.254: v2(20.95,10.8) 20.91,10.8 20.57,10.45 DRV1.9 ; v2(15.75,12.06) 14.73,12.06 12.7,14.1 12.7,16.26 12.06,16.89 10.04,16.89 R19.2 R20.1
  Bottom Layer w0.254: v2(15.75,12.06) 19.68,12.06 v2(20.95,10.8)
M1SHA: length 15.8
  Top Layer w0.254: DRV1.18 18.42,4.39 C21.1 18.22,4.45 11.8,4.45 R10.2 10.28,5.97 9.27,5.97 8.64,6.6 8.13,6.6 7.87,6.86 7.87,7.75 8.06,7.93 8.63,7.93
  vias: v3(3.43,8.76) v3(3.43,7.75) v3(3.81,8.25) v3(3.81,7.24) v3(4.19,8.76) v3(4.19,7.75) v3(4.57,8.25) v3(4.57,7.24) v3(4.95,8.76) v3(4.95,7.75) v3(5.33,8.25) v3(5.33,7.24) v3(5.71,8.76) v3(5.71,7.75) v3(6.1,8.25) v3(6.1,7.24) v3(6.48,8.76) v3(6.48,7.75) v3(6.86,9.27) v3(6.86,8.25) v3(6.86,7.24) v3(7.24,8.76) v3(7.24,7.75) v3(7.62,9.27) v3(7.62,8.25) v3(7.62,7.24)
M1SHB: length 15.6
  Top Layer w0.254: Q3.3 8.06,14.92 7.87,14.73 7.87,13.84 8.13,13.59 8.64,13.59 9.14,13.08 10.15,13.08 R14.2 11.8,11.43 15.49,11.43 16.51,10.41 C22.1 16.71,8.38 DRV1.15
  vias: v3(3.43,15.75) v3(3.43,14.73) v3(3.81,15.24) v3(3.81,14.22) v3(4.19,15.75) v3(4.19,14.73) v3(4.57,15.24) v3(4.57,14.22) v3(4.95,15.75) v3(4.95,14.73) v3(5.33,15.24) v3(5.33,14.22) v3(5.71,15.75) v3(5.71,14.73) v3(6.1,15.24) v3(6.1,14.22) v3(6.48,15.75) v3(6.48,14.73) v3(6.86,16.26) v3(6.86,15.24) v3(6.86,14.22) v3(7.24,15.75) v3(7.24,14.73) v3(7.62,16.26) v3(7.62,15.24) v3(7.62,14.22)
M1SHC: length 20.1
  Top Layer w0.254: Q5.3 8.06,21.9 7.87,21.72 7.87,20.83 8.13,20.57 8.64,20.57 9.14,20.07 10.15,20.07 R18.2 11.8,18.42 13.33,18.42 14.22,17.53 14.22,14.48 15.37,13.34 16.58,13.34 C23.1 18.1,12.64 18.67,12.06 18.67,10.41 19.05,10.03 DRV1.12
  vias: v3(3.43,22.73) v3(3.43,21.72) v3(3.81,22.23) v3(3.81,21.21) v3(4.19,22.73) v3(4.19,21.72) v3(4.57,22.23) v3(4.57,21.21) v3(4.95,22.73) v3(4.95,21.72) v3(5.33,22.23) v3(5.33,21.21) v3(5.71,22.73) v3(5.71,21.72) v3(6.1,22.23) v3(6.1,21.21) v3(6.48,22.73) v3(6.48,21.72) v3(6.86,23.24) v3(6.86,22.23) v3(6.86,21.21) v3(7.24,22.73) v3(7.24,21.72) v3(7.62,23.24) v3(7.62,22.23) v3(7.62,21.21)
M2AH: length 10
  Top Layer w0.152: v3(40.77,8.05) MCU.3 ; v1(45.47,10.92) 45.47,10.92 DRV2.22
  Bottom Layer w0.152: v3(40.77,8.05) 41.85,8.05 42.28,7.62 43.31,7.62 43.69,8 43.69,9.78 44.32,10.41 44.96,10.41 v1(45.47,10.92)
M2AL: length 5.4
  Top Layer w0.152: MCU.4 41.06,8.55 42.02,9.5 DRV2.1
M2BH: length 9.5
  Top Layer w0.152: DRV2.23 44.97,10.66 v1(44.7,10.92) ; v1(40.77,9.05) MCU.5
  Bottom Layer w0.152: v1(40.77,9.05) 41.5,9.05 42.55,8 43.05,8 43.28,8.23 43.28,10.01 44.2,10.92 v1(44.7,10.92)
M2BL: length 5.3
  Top Layer w0.152: v1(42.29,9.02) 43.81,9.02 DRV2.2 ; v1(41.27,9.55) MCU.6
  Bottom Layer w0.152: v1(42.29,9.02) 41.76,9.55 v1(41.27,9.55)
M2CH: length 6
  Top Layer w0.152: DRV2.24 42.67,10.16 42.29,9.78 41.78,9.78 41.52,10.05 MCU.7
M2CL: length 6.5
  Top Layer w0.152: MCU.8 41.78,10.55 v1(42.04,10.29) ; v1(42.8,8.51) 42.8,8.5 DRV2.3 43.82,8.51
  Bottom Layer w0.152: v1(42.8,8.51) 42.8,9.53 v1(42.04,10.29)
M2GHA: length 18.2
  Top Layer w0.254: R22.1 R21.2 52.44,22.34 51.94,21.84 51.94,17.4 50.04,15.49 50.04,13.72 49.4,13.08 47.37,13.08 46.97,12.68 DRV2.19
M2GHB: length 12.7
  Top Layer w0.254: R26.1 R25.2 53.33,15.37 52.7,15.37 51.94,14.61 51.94,10.29 50.16,8.5 DRV2.16
M2GHC: length 10.6
  Top Layer w0.254: DRV2.13 47.86,7 48.51,6.35 48.51,5.84 48.89,5.46 51.56,5.46 51.94,5.84 51.94,7.62 52.7,8.38 53.33,8.38 R29.2 R30.1
M2GLA: length 28.1
  Top Layer w0.254: DRV2.11 46.47,5.73 46.61,5.59 v2(47.24,5.59) ; R24.1 R23.2 56,23.11 51.31,23.11 50.17,21.97 v2(50.17,16.51)
  Bottom Layer w0.254: v2(47.24,5.59) 48.89,7.24 48.89,7.62 49.53,8.25 49.53,10.54 50.17,11.18 v2(50.17,16.51)
M2GLB: length 22.2
  Top Layer w0.254: DRV2.10 45.97,5.47 46.48,4.95 v2(47.75,4.95) ; v2(50.17,10.16) 51.31,11.3 51.31,14.86 52.58,16.13 56,16.13 R27.2 R28.1
  Bottom Layer w0.254: v2(47.75,4.95) 49.53,6.73 49.53,7.37 50.17,8 v2(50.17,10.16)
M2GLC: length 17.2
  Top Layer w0.254: DRV2.9 45.47,5.2 46.36,4.32 v2(48.26,4.32) ; R32.1 R31.2 56,9.14 52.6,9.14 50.44,6.98 v2(50.17,6.98)
  Bottom Layer w0.254: v2(48.26,4.32) 50.17,6.22 v2(50.17,6.98)
M2SHA: length 23.5
  Top Layer w0.254: Q7.3 57.47,18.16 57.91,18.16 58.17,18.42 58.17,19.18 57.91,19.43 57.4,19.43 56.9,19.94 55.89,19.94 R22.2 54.24,21.59 52.83,21.59 52.58,21.34 52.58,17.14 50.67,15.24 50.67,12.83 49.91,12.06 C25.1 47.69,9.58 DRV2.18
  vias: v3(58.29,18.8) v3(58.29,17.78) v3(58.29,16.76) v3(58.67,18.29) v3(58.67,17.27) v3(59.05,18.8) v3(59.05,17.78) v3(59.05,16.76) v3(59.44,18.29) v3(59.44,17.27) v3(59.82,18.8) v3(59.82,17.78) v3(60.2,18.29) v3(60.2,17.27) v3(60.58,18.8) v3(60.58,17.78) v3(60.96,18.29) v3(60.96,17.27) v3(61.34,18.8) v3(61.34,17.78) v3(61.72,18.29) v3(61.72,17.27) v3(62.1,18.8) v3(62.1,17.78) v3(62.48,18.29) v3(62.48,17.27)
M2SHB: length 18.6
  Top Layer w0.254: Q9.3 57.98,11.12 58.17,11.3 58.17,12.06 57.91,12.32 57.53,12.32 56.9,12.95 55.89,12.95 R26.2 54.24,14.61 52.83,14.61 52.58,14.35 52.58,10.03 50.35,7.81 C26.1 49.33,8 DRV2.15
  vias: v3(58.29,11.68) v3(58.29,10.67) v3(58.29,9.65) v3(58.67,11.18) v3(58.67,10.16) v3(59.05,11.68) v3(59.05,10.67) v3(59.05,9.65) v3(59.44,11.18) v3(59.44,10.16) v3(59.82,11.68) v3(59.82,10.67) v3(60.2,11.18) v3(60.2,10.16) v3(60.58,11.68) v3(60.58,10.67) v3(60.96,11.18) v3(60.96,10.16) v3(61.34,11.68) v3(61.34,10.67) v3(61.72,11.18) v3(61.72,10.16) v3(62.1,11.68) v3(62.1,10.67) v3(62.48,11.18) v3(62.48,10.16)
M2SHC: length 17.3
  Top Layer w0.254: DRV2.12 47.75,6.36 48.01,6.1 48.01,5.59 48.83,4.76 C27.1 51.75,4.76 52.58,5.59 52.58,7.37 52.83,7.62 54.24,7.62 R30.2 55.89,5.97 57.02,5.97 57.66,5.33 58.04,5.33 58.42,4.95 v3(58.42,4.7) 58.42,4.32 58.24,4.14 Q11.3
  vias: v3(58.42,3.68) v3(58.42,2.67) v3(58.8,4.19) v3(58.8,3.17) v3(59.18,4.7) v3(59.18,3.68) v3(59.18,2.67) v3(59.56,4.19) v3(59.56,3.17) v3(59.94,4.7) v3(59.94,3.68) v3(60.33,4.19) v3(60.33,3.17) v3(60.71,4.7) v3(60.71,3.68) v3(61.09,4.19) v3(61.09,3.17) v3(61.47,4.7) v3(61.47,3.68) v3(61.85,4.19) v3(61.85,3.17) v3(62.23,4.7) v3(62.23,3.68) v3(62.61,4.19) v3(62.61,3.17)
RESET: length 14
  Top Layer w0.254: DAP.1 40.77,0.76 35.94,0.76 RESET.1 34.04,2.66 R1.1 32.97,2.61 31.77,2.61 ; C10.1 31.37,3.19 31.77,3.59 MCU.54
UART_RX: length 13.6
  Top Layer w0.254: MCU.18 36.27,17.86 36.7,18.29 38.35,18.29 40.13,20.07 40.13,21.72 40.64,22.23 41.53,22.23 42,22.69 UART.1
UART_TX: length 12.1
  Top Layer w0.254: MCU.19 35.77,18.12 36.58,18.92 38.1,18.92 39.5,20.32 UART.2
$1N1857: length 8.2
  Bottom Layer w0.508: DAP.10 50.42,3.56 46.66,3.56 D1.2
$1N2887: length 1.8
  Top Layer w0.254: 45.71,20.33 45.72,20.33 R3.2
$1N2902: length 2
  Top Layer w0.254: R4.2 43.18,14.23 LED2.2
$1N5314: length 4.5
  Top Layer w0.254: v1(33.78,6.48) 33.77,6.47 MCU.58
  Bottom Layer w0.254: C4.2 32.58,7.05 32.77,7.24 C28.2 33.84,6.54 v1(33.78,6.48)
$2N565: length 5.7
  Bottom Layer w0.254: U1.2 33.8,15.88 34.16,15.52 34.16,14.85 35.68,13.34 C13.1
$2N574: length 4
  Bottom Layer w0.254: C13.2 37.78,14.35 36.01,14.35 U1.6
$2N1032: length 3.8
  Bottom Layer w0.254: U1.4 37.03,16.83 R8.1 R7.2
$2N1462: length 6.9
  Bottom Layer w0.508: C19.2 35,1.91 D3.2 36.32,4.7 37.15,5.53 U2.5
$2N2541: length 4.9
  Top Layer w0.254: Q1.4 9.3,6.6 11.29,6.6 R9.1
$2N2559: length 3.6
  Top Layer w0.254: R11.1 8.38,6.09 Q2.4
$2N3129: length 4.9
  Top Layer w0.254: Q3.4 9.3,13.59 11.29,13.59 R13.1
$2N3132: length 3.6
  Top Layer w0.254: R15.1 8.38,13.07 Q4.4
$2N3427: length 4.9
  Top Layer w0.254: Q5.4 9.3,20.57 11.29,20.57 R17.1
$2N3430: length 3.6
  Top Layer w0.254: R19.1 8.38,20.06 Q6.4
$2N4215: length 4.9
  Top Layer w0.254: Q7.4 56.74,19.43 54.75,19.43 R21.1
$2N4218: length 3.6
  Top Layer w0.254: Q8.4 57.66,19.95 R23.1
$2N4270: length 4.9
  Top Layer w0.254: Q9.4 56.74,12.45 54.75,12.45 R25.1
$2N4273: length 3.6
  Top Layer w0.254: R27.1 57.66,12.96 Q10.4
$2N4325: length 5.1
  Top Layer w0.254: Q11.4 56.86,5.46 54.75,5.46 R29.1
$2N4328: length 3.6
  Top Layer w0.254: R31.1 57.66,5.98 Q12.4
$2N5197: length 2
  Top Layer w0.254: C21.2 19.57,4.5 DRV1.20
$2N5203: length 2
  Top Layer w0.254: DRV1.17 16.71,7.38 16.51,7.17
$2N5219: length 3.3
  Top Layer w0.254: C23.2 17.27,9.27 17.67,8.88 DRV1.14
$2N5621: length 2
  Top Layer w0.254: DRV2.20 46.47,11.89 C25.2
$2N5626: length 2
  Top Layer w0.254: C26.2 49.33,9 DRV2.17
$2N5629: length 2.5
  Top Layer w0.254: C27.2 48.19,7.5 DRV2.14
$2N6397:
  vias: v3(0.63,6.22) v3(0.63,5.21) v3(0.63,4.19) v3(0.63,3.17) v3(1.02,5.72) v3(1.02,4.7) v3(1.02,3.68) v3(1.4,6.22) v3(1.4,5.21) v3(1.4,4.19) v3(1.4,3.17) v3(1.78,5.72) v3(1.78,4.7) v3(1.78,3.68) v3(2.16,6.22) v3(2.16,5.21) v3(2.16,4.19) v3(2.16,3.17) v3(2.54,5.72) v3(2.54,4.7) v3(2.54,3.68) v3(2.92,6.22) v3(2.92,5.21) v3(2.92,4.19) v3(2.92,3.17) v3(3.3,5.72) v3(3.3,4.7) v3(3.3,3.68) v3(3.68,5.21) v3(3.68,4.19) v3(3.68,3.17) v3(4.06,4.7) v3(4.06,3.68) v3(4.44,5.21) v3(4.44,4.19) v3(4.44,3.17) v3(4.83,4.7) v3(4.83,3.68) v3(5.21,5.21) v3(5.21,4.19) v3(5.21,3.17) v3(5.59,4.7) v3(5.59,3.68) v3(5.97,5.21) v3(5.97,4.19) v3(5.97,3.17) v3(6.35,4.7) v3(6.35,3.68) v3(6.73,5.21)
$2N6459:
  vias: v3(0.63,13.21) v3(0.63,12.19) v3(0.63,11.18) v3(0.63,10.16) v3(1.02,12.7) v3(1.02,11.68) v3(1.02,10.67) v3(1.4,13.21) v3(1.4,12.19) v3(1.4,11.18) v3(1.4,10.16) v3(1.78,12.7) v3(1.78,11.68) v3(1.78,10.67) v3(2.16,13.21) v3(2.16,12.19) v3(2.16,11.18) v3(2.16,10.16) v3(2.54,12.7) v3(2.54,11.68) v3(2.54,10.67) v3(2.92,13.21) v3(2.92,12.19) v3(2.92,11.18) v3(2.92,10.16) v3(3.3,12.7) v3(3.3,11.68) v3(3.3,10.67) v3(3.68,12.19) v3(3.68,11.18) v3(3.68,10.16) v3(4.06,11.68) v3(4.06,10.67) v3(4.44,12.19) v3(4.44,11.18) v3(4.44,10.16) v3(4.83,11.68) v3(4.83,10.67) v3(5.21,12.19) v3(5.21,11.18) v3(5.21,10.16) v3(5.59,11.68) v3(5.59,10.67) v3(5.97,12.19) v3(5.97,11.18) v3(5.97,10.16) v3(6.35,11.68) v3(6.35,10.67) v3(6.73,12.19)
$2N6493:
  vias: v3(0.63,20.19) v3(0.63,19.18) v3(0.63,18.16) v3(0.63,17.14) v3(1.02,19.69) v3(1.02,18.67) v3(1.02,17.65) v3(1.4,20.19) v3(1.4,19.18) v3(1.4,18.16) v3(1.4,17.14) v3(1.78,19.69) v3(1.78,18.67) v3(1.78,17.65) v3(2.16,20.19) v3(2.16,19.18) v3(2.16,18.16) v3(2.16,17.14) v3(2.54,19.69) v3(2.54,18.67) v3(2.54,17.65) v3(2.92,20.19) v3(2.92,19.18) v3(2.92,18.16) v3(2.92,17.14) v3(3.3,19.69) v3(3.3,18.67) v3(3.3,17.65) v3(3.68,19.18) v3(3.68,18.16) v3(3.68,17.14) v3(4.06,18.67) v3(4.06,17.65) v3(4.44,19.18) v3(4.44,18.16) v3(4.44,17.14) v3(4.83,18.67) v3(4.83,17.65) v3(5.21,19.18) v3(5.21,18.16) v3(5.21,17.14) v3(5.59,18.67) v3(5.59,17.65) v3(5.97,19.18) v3(5.97,18.16) v3(5.97,17.14) v3(6.35,18.67) v3(6.35,17.65) v3(6.73,19.18)
$2N6527:
  vias: v3(59.31,21.84) v3(59.69,22.35) v3(59.69,21.34) v3(60.07,22.86) v3(60.07,21.84) v3(60.45,22.35) v3(60.45,21.34) v3(60.83,22.86) v3(60.83,21.84) v3(60.83,20.83) v3(61.21,22.35) v3(61.21,21.34) v3(61.59,22.86) v3(61.59,21.84) v3(61.59,20.83) v3(61.98,22.35) v3(61.98,21.34) v3(62.36,22.86) v3(62.36,21.84) v3(62.36,20.83) v3(62.74,22.35) v3(62.74,21.34) v3(62.74,20.32) v3(63.12,22.86) v3(63.12,21.84) v3(63.12,20.83) v3(63.12,19.81) v3(63.5,22.35) v3(63.5,21.34) v3(63.5,20.32) v3(63.88,22.86) v3(63.88,21.84) v3(63.88,20.83) v3(63.88,19.81) v3(64.26,22.35) v3(64.26,21.34) v3(64.26,20.32) v3(64.64,22.86) v3(64.64,21.84) v3(64.64,20.83) v3(64.64,19.81) v3(65.02,22.35) v3(65.02,21.34) v3(65.02,20.32) v3(65.4,22.86) v3(65.4,21.84) v3(65.4,20.83) v3(65.4,19.81)
$2N6561:
  vias: v3(59.31,14.73) v3(59.69,15.24) v3(59.69,14.22) v3(60.07,15.75) v3(60.07,14.73) v3(60.45,15.24) v3(60.45,14.22) v3(60.83,15.75) v3(60.83,14.73) v3(60.83,13.72) v3(61.21,15.24) v3(61.21,14.22) v3(61.59,15.75) v3(61.59,14.73) v3(61.59,13.72) v3(61.98,15.24) v3(61.98,14.22) v3(62.36,15.75) v3(62.36,14.73) v3(62.36,13.72) v3(62.74,15.24) v3(62.74,14.22) v3(62.74,13.21) v3(63.12,15.75) v3(63.12,14.73) v3(63.12,13.72) v3(63.12,12.7) v3(63.5,15.24) v3(63.5,14.22) v3(63.5,13.21) v3(63.88,15.75) v3(63.88,14.73) v3(63.88,13.72) v3(63.88,12.7) v3(64.26,15.24) v3(64.26,14.22) v3(64.26,13.21) v3(64.64,15.75) v3(64.64,14.73) v3(64.64,13.72) v3(64.64,12.7) v3(65.02,15.24) v3(65.02,14.22) v3(65.02,13.21) v3(65.4,15.75) v3(65.4,14.73) v3(65.4,13.72) v3(65.4,12.7)
$2N6595:
  vias: v3(59.31,7.75) v3(59.69,8.25) v3(59.69,7.24) v3(60.07,8.76) v3(60.07,7.75) v3(60.45,8.25) v3(60.45,7.24) v3(60.83,8.76) v3(60.83,7.75) v3(60.83,6.73) v3(61.21,8.25) v3(61.21,7.24) v3(61.59,8.76) v3(61.59,7.75) v3(61.59,6.73) v3(61.98,8.25) v3(61.98,7.24) v3(62.36,8.76) v3(62.36,7.75) v3(62.36,6.73) v3(62.74,8.25) v3(62.74,7.24) v3(62.74,6.22) v3(63.12,8.76) v3(63.12,7.75) v3(63.12,6.73) v3(63.12,5.72) v3(63.5,8.25) v3(63.5,7.24) v3(63.5,6.22) v3(63.88,8.76) v3(63.88,7.75) v3(63.88,6.73) v3(63.88,5.72) v3(64.26,8.25) v3(64.26,7.24) v3(64.26,6.22) v3(64.64,8.76) v3(64.64,7.75) v3(64.64,6.73) v3(64.64,5.72) v3(65.02,8.25) v3(65.02,7.24) v3(65.02,6.22) v3(65.4,8.76) v3(65.4,7.75) v3(65.4,6.73) v3(65.4,5.72)

## Copper pours and planes (outline as drawn; the poured copper is in the pictures)
+5V on Bottom Layer: 25.91,10.03 26.16,10.29 30.48,10.29 30.99,10.8 36.07,10.8 36.45,11.18 36.45,11.94 36.83,12.32 37.71,12.32 38.11,11.92 38.11,10.8 37.59,10.29 37.59,8.76 37.46,8.64 30.86,8.64 29.84,7.62 26.03,7.62 25.91,7.75
GND on Top Layer: -8.76,36.83 71.5,36.83 71.5,-0.51 -8.76,-0.51
GND on Bottom Layer: -3.56,38.61 68.58,38.61 68.58,-2.67 -3.56,-2.67
GND on Bottom Layer: 50.55,23.5 53.47,23.5 53.47,5.33 50.55,5.33
GND on Bottom Layer: 12.45,24.77 53.47,24.77 53.47,20.95 12.45,20.95
GND on Bottom Layer: 12.45,23.5 15.37,23.5 15.37,2.41 12.45,2.41
GND on Bottom Layer: 26.8,36.2 31.62,36.2 31.62,24 26.8,24
GND on Inner1: 0.26,34.67 17.52,34.67 17.52,23.8 0.26,23.8
GND on Inner1: 0.26,34.67 65.78,34.67 65.78,0.26 0.26,0.26
GND on Inner2: 0.26,34.67 65.78,34.67 65.78,0.26 0.26,0.26
GND on Inner2: 0.26,34.67 17.52,34.67 17.52,23.8 0.26,23.8
BAT on Top Layer: 25.4,36.2 25.4,30.48 22.86,27.94 22.86,24.77 20.57,22.48 18.16,22.48 17.78,22.86 17.78,36.2
BAT on Top Layer: 20.57,22.48 20.95,22.48 23.11,20.32 23.11,19.94 23.49,19.56 24.64,19.56 25.27,20.19 25.27,22.35 22.61,25.02 22.48,25.02 20.57,23.11
BAT on Bottom Layer: 33.65,16.38 33.91,16.64 33.91,18.96 33.68,19.18 32.52,19.18 31.75,18.42 29.59,18.42 29.21,18.03 29.21,17.06 29.88,16.38
BAT on Bottom Layer: 17.78,28.19 17.78,36.2 25.4,36.2 25.4,27.8 18.17,27.8
BAT on Bottom Layer: 9.27,28.58 12.19,28.58 12.19,6.7 9.27,6.7
BAT on Bottom Layer: 9.27,28.58 26.8,28.58 26.8,25.02 9.27,25.02
BAT on Bottom Layer: 23.11,20.7 25.02,20.7 25.27,20.45 25.27,19.05 25.53,18.8 29.34,18.8 29.72,18.42 29.72,17.27 29.46,17.02 24.26,17.02 23.11,18.16
BAT on Bottom Layer: 53.79,28.59 56.71,28.59 56.71,2.39 53.79,2.39
BAT on Bottom Layer: 31.88,28.58 56.64,28.58 56.64,25.02 31.88,25.02
BAT on Inner1: 31.75,28.6 56.77,28.6 56.77,2.35 31.75,2.35
BAT on Inner1: 9.43,34.67 25.27,34.67 25.27,6.73 9.43,6.73
BAT on Inner2: 9.43,34.67 25.27,34.67 25.27,6.73 9.43,6.73
BAT on Inner2: 31.75,28.6 56.77,28.6 56.77,2.35 31.75,2.35
M1SHA on Top Layer: 9.14,7.62 8.51,7.62 7.75,6.86 -2.54,6.86 -2.54,9.65 9.14,9.65
M1SHA on Bottom Layer: 9.14,7.62 8.51,7.62 7.75,6.86 -2.54,6.86 -2.54,9.65 9.14,9.65
M1SHA on Inner1: 0.26,9.65 9.17,9.65 9.17,6.86 0.26,6.86
M1SHA on Inner2: 0.26,9.65 9.17,9.65 9.17,6.86 0.26,6.86
M1SHB on Top Layer: 9.14,14.61 8.51,14.61 7.75,13.84 -2.54,13.84 -2.54,16.64 9.14,16.64
M1SHB on Bottom Layer: 9.14,14.61 8.51,14.61 7.75,13.84 -2.54,13.84 -2.54,16.64 9.14,16.64
M1SHB on Inner1: 0.26,16.62 9.17,16.62 9.17,13.88 0.26,13.88
M1SHB on Inner2: 0.26,16.62 9.17,16.62 9.17,13.88 0.26,13.88
M1SHC on Top Layer: 9.14,21.59 8.51,21.59 7.75,20.83 -2.54,20.83 -2.54,23.62 9.14,23.62
M1SHC on Bottom Layer: 9.14,21.59 8.51,21.59 7.75,20.83 -2.54,20.83 -2.54,23.62 9.14,23.62
M1SHC on Inner1: 0.26,23.54 9.17,23.54 9.17,20.83 0.26,20.83
M1SHC on Inner2: 0.26,23.54 9.17,23.54 9.17,20.83 0.26,20.83
M2SHA on Top Layer: 56.9,18.41 57.28,18.41 58.17,19.3 67.31,19.3 67.31,16.26 56.9,16.26
M2SHA on Bottom Layer: 56.9,18.41 57.28,18.41 58.17,19.3 67.31,19.3 67.31,16.26 56.9,16.26
M2SHA on Inner1: 57.03,19.3 65.78,19.3 65.78,16.26 57.03,16.26
M2SHA on Inner2: 57.03,19.3 65.78,19.3 65.78,16.26 57.03,16.26
M2SHB on Top Layer: 56.9,11.43 57.4,11.43 58.17,12.19 67.31,12.19 67.31,9.27 56.9,9.27 56.9,11.43
M2SHB on Bottom Layer: 56.9,11.43 57.4,11.43 58.17,12.19 67.31,12.19 67.31,9.27 56.9,9.27 56.9,11.43
M2SHB on Inner1: 57.03,12.16 65.78,12.16 65.78,9.32 57.03,9.32
M2SHB on Inner2: 57.03,12.16 65.78,12.16 65.78,9.32 57.03,9.32
M2SHC on Top Layer: 56.9,4.44 57.53,4.44 58.29,5.21 67.31,5.21 67.31,2.29 56.9,2.29
M2SHC on Bottom Layer: 56.9,4.44 57.53,4.44 58.29,5.21 67.31,5.21 67.31,2.29 56.9,2.29
M2SHC on Inner1: 57.02,5.21 65.78,5.21 65.78,2.35 57.02,2.35
M2SHC on Inner2: 57.02,5.21 65.78,5.21 65.78,2.35 57.02,2.35
$2N565 on Bottom Layer: 33.88,16 33.65,16.22 33.65,16.26 30.01,16.26 29.77,16.5 26.15,16.5 25.91,16.26 25.91,14.1 26.16,13.84 30.48,13.84 32,15.37 33.65,15.37 33.88,15.59
$2N6397 on Top Layer: -2.54,6.6 8.51,6.6 8.51,2.92 -2.54,2.92
$2N6397 on Bottom Layer: -2.54,6.6 9.02,6.6 9.02,2.92 -2.54,2.92
$2N6397 on Inner1: 0.26,6.6 9.12,6.6 9.12,2.92 0.26,2.92
$2N6397 on Inner2: 0.26,6.6 9.12,6.6 9.12,2.92 0.26,2.92
$2N6459 on Top Layer: -2.54,13.59 8.51,13.59 8.51,9.91 -2.54,9.91
$2N6459 on Bottom Layer: -2.54,13.59 9.02,13.59 9.02,9.91 -2.54,9.91
$2N6459 on Inner1: 0.26,13.62 9.17,13.62 9.17,9.91 0.26,9.91
$2N6459 on Inner2: 0.26,13.62 9.17,13.62 9.17,9.91 0.26,9.91
$2N6493 on Top Layer: -2.54,20.57 8.51,20.57 8.51,16.89 -2.54,16.89
$2N6493 on Bottom Layer: -2.54,20.57 9.02,20.57 9.02,16.89 -2.54,16.89
$2N6493 on Inner1: 0.26,20.57 9.17,20.57 9.17,16.87 0.26,16.87
$2N6493 on Inner2: 0.26,20.57 9.17,20.57 9.17,16.87 0.26,16.87
$2N6527 on Top Layer: 60.33,19.56 67.31,19.56 67.31,23.11 57.76,23.11 57.76,20.73 57.91,20.57 60.07,20.57 60.33,20.32
$2N6527 on Bottom Layer: 56.9,23.11 67.31,23.11 67.31,19.56 56.9,19.56
$2N6527 on Inner1: 57.03,23.11 65.78,23.11 65.78,19.56 57.03,19.56
$2N6527 on Inner2: 57.03,23.11 65.78,23.11 65.78,19.56 57.03,19.56
$2N6561 on Top Layer: 60.33,12.45 67.31,12.45 67.31,16 57.76,16 57.76,13.61 57.91,13.46 60.07,13.46 60.33,13.21
$2N6561 on Bottom Layer: 56.9,16 67.31,16 67.31,12.45 56.9,12.45
$2N6561 on Inner1: 57.03,16 65.78,16 65.78,12.41 57.03,12.41
$2N6561 on Inner2: 57.03,16 65.78,16 65.78,12.41 57.03,12.41
$2N6595 on Top Layer: 60.33,5.46 67.31,5.46 67.31,9.02 57.76,9.02 57.76,6.5 57.91,6.35 60.07,6.35 60.33,6.1
$2N6595 on Bottom Layer: 56.9,9.02 67.31,9.02 67.31,5.46 56.9,5.46
$2N6595 on Inner1: 57.03,9.07 65.78,9.07 65.78,5.46 57.03,5.46
$2N6595 on Inner2: 57.03,9.07 65.78,9.07 65.78,5.46 57.03,5.46

## Text on the board
Bottom Silkscreen Layer: RX | TX | GND | 3V3
Top Silkscreen Layer: +5V | SCK | MOSI | MISO | CS | GND | TX | RX | RST | CLK | DIO
